# Altium schematic sheet PowerSupply.SchDoc
size A
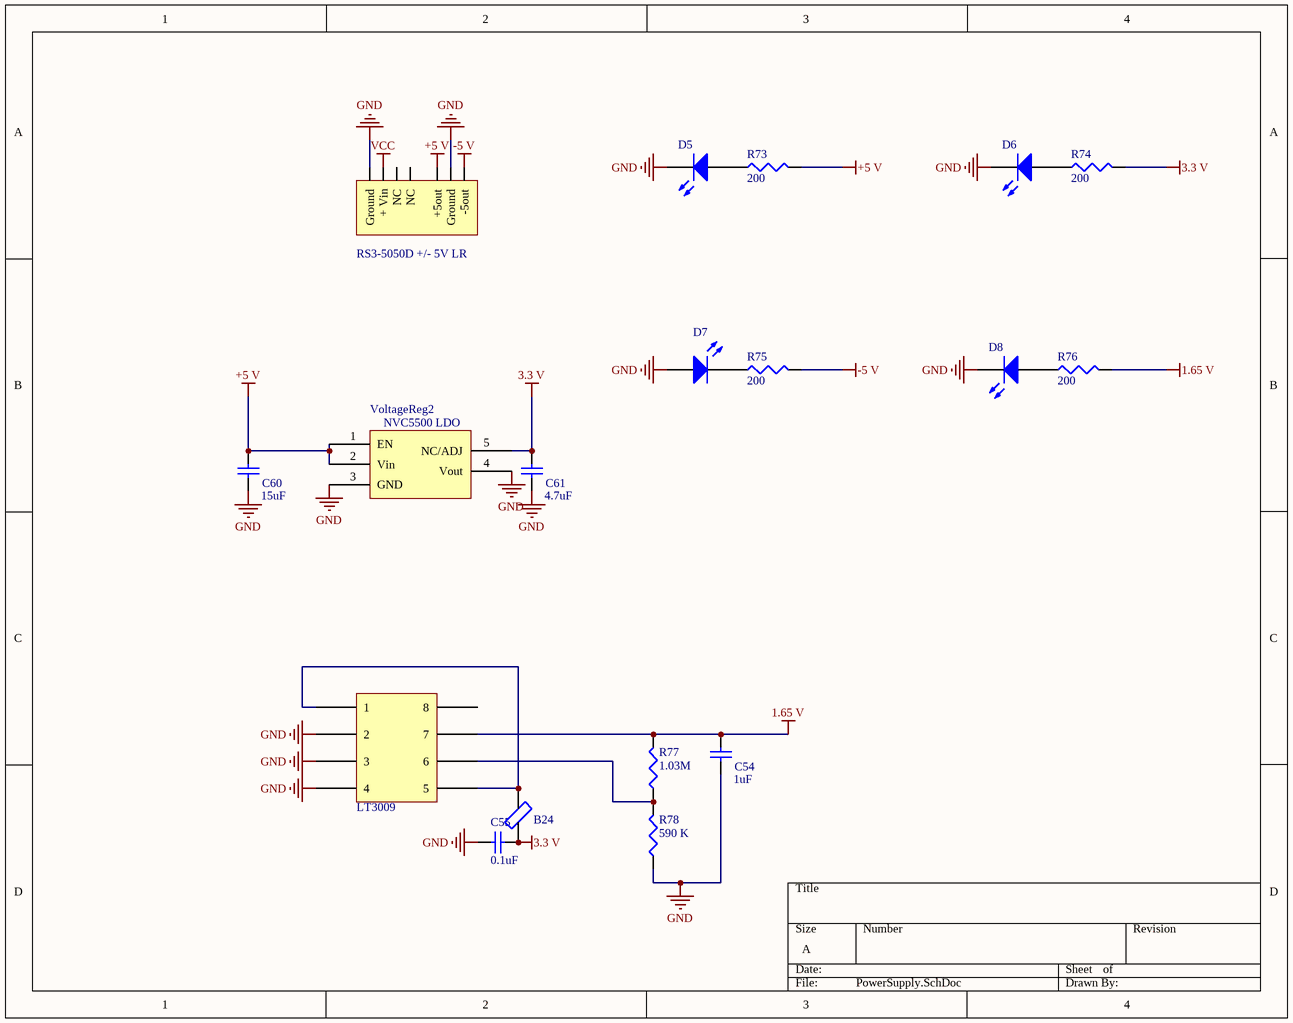
[diagram p0: PowerSupply.SchDoc]

## Parts
?  RS3-5050D +/- 5V LR  [+/- 5 V LR]
B24  Ferrite Bead  [Resistor 0603]  (value not drawn)
C54  value 1uF  [Capacitor 0603]  (hidden comment: 4.7uF 20V Ceramic)
C55  value 0.1uF  [C1206]  (hidden comment: .1uF 20V Ceramic Low ESR)
C60  value 15uF  [C1206]  (hidden comment: 15uF 20V Ceramic)
C61  value 4.7uF  [C1206]  (hidden comment: 4.7uF 20V Ceramic)
D5  LED2  [Resistor 0603]  (value not drawn)
D6  LED2  [Resistor 0603]  (value not drawn)
D7  LED2  [Resistor 0603]  (value not drawn)
D8  LED2  [Resistor 0603]  (value not drawn)
LT3009  LT3009  [SC8 Package]  (value not drawn)
R73  value 200  [Capacitor 0603]  (hidden comment: 200 ohms 1%)
R74  value 200  [Capacitor 0603]  (hidden comment: 200 ohms 1%)
R75  value 200  [Capacitor 0603]  (hidden comment: 200 ohms 1%)
R76  value 200  [Capacitor 0603]  (hidden comment: 200 ohms 1%)
R77  value 1.03M  [Capacitor 0603]  (hidden comment: 1.03 M 603)
R78  value 590 K  [Capacitor 0603]  (hidden comment: 590 K 603)
VoltageReg2  NCP5500DT33RKG DPAK-5  [DPAK5]  (value not drawn)

## Nets
1.65 V: C54.2 LT3009.7 R76.2 R77.2
3.3 V: B24.1 C55.1 C61.2 R74.2 VoltageReg2.5(NC/ADJ)
+5 V: ?.5(+5out) C60.2 R73.2 VoltageReg2.1(EN) VoltageReg2.2(Vin)
-5 V: ?.7(-5out) R75.2
GND: ?.0(Ground) ?.6(Ground) C54.1 C55.2 C60.1 C61.1 D5.2(K) D6.2(K) D7.1(A) D8.2(K) LT3009.2 LT3009.3 LT3009.4 R78.1 VoltageReg2.3(GND) VoltageReg2.4(Vout)
VCC: ?.1(+_Vin)
NetB24_2: B24.2 LT3009.1 LT3009.5
NetD5_1: D5.1(A) R73.1
NetD6_1: D6.1(A) R74.1
NetD7_2: D7.2(K) R75.1
NetD8_1: D8.1(A) R76.1
NetLT3009_6: LT3009.6 R77.1 R78.2

Not connected (* = marked no-connect by the designer): ? 2(NC) 3(NC); LT3009 8

## Notes on the sheet
- (in symbol NCV5500 LDO DPAK-5) NVC5500 LDO

## Library data of the parts
B24 = Ferrite Bead: Ferrite Bead: 200 Ohm @ 25 Mhz
C54 C55 C60 C61 = Cap Semi: Capacitor (Semiconductor SIM Model); Published: 8-Jun-2000; LatestRevisionDate: 29-May-2009; LatestRevisionNote: IPC-7351 Footprint Added.; PackageReference: C1206; Publisher: Altium Limited; PackageDescription: Chip Capacitor
D5-D8 = LED2: Typical RED, GREEN, YELLOW, AMBER GaAs LED; Published: 8-Jun-2000; LatestRevisionDate: 17-Jul-2002; LatestRevisionNote: Re-released for DXP Platform.; PackageVersion: Feb-2002; PackageReference: 3.2X1.6X1.1; Publisher: Altium Limited; PackageDescription: SM LED; 2 Flat Leads
R73-R78 = Res3: Resistor; Published: 8-Jun-2000; LatestRevisionDate: 29-May-2009; LatestRevisionNote: IPC-7351 Footprint Added.; PackageReference: J1-0603; Publisher: Altium Limited; PackageDescription: Chip Resistor
VoltageReg2 = NCV5500 LDO DPAK-5